# Altium schematic sheet MCU.SchDoc
size 420 x 297 mm; SheetNumber: 7; SheetTotal: 15
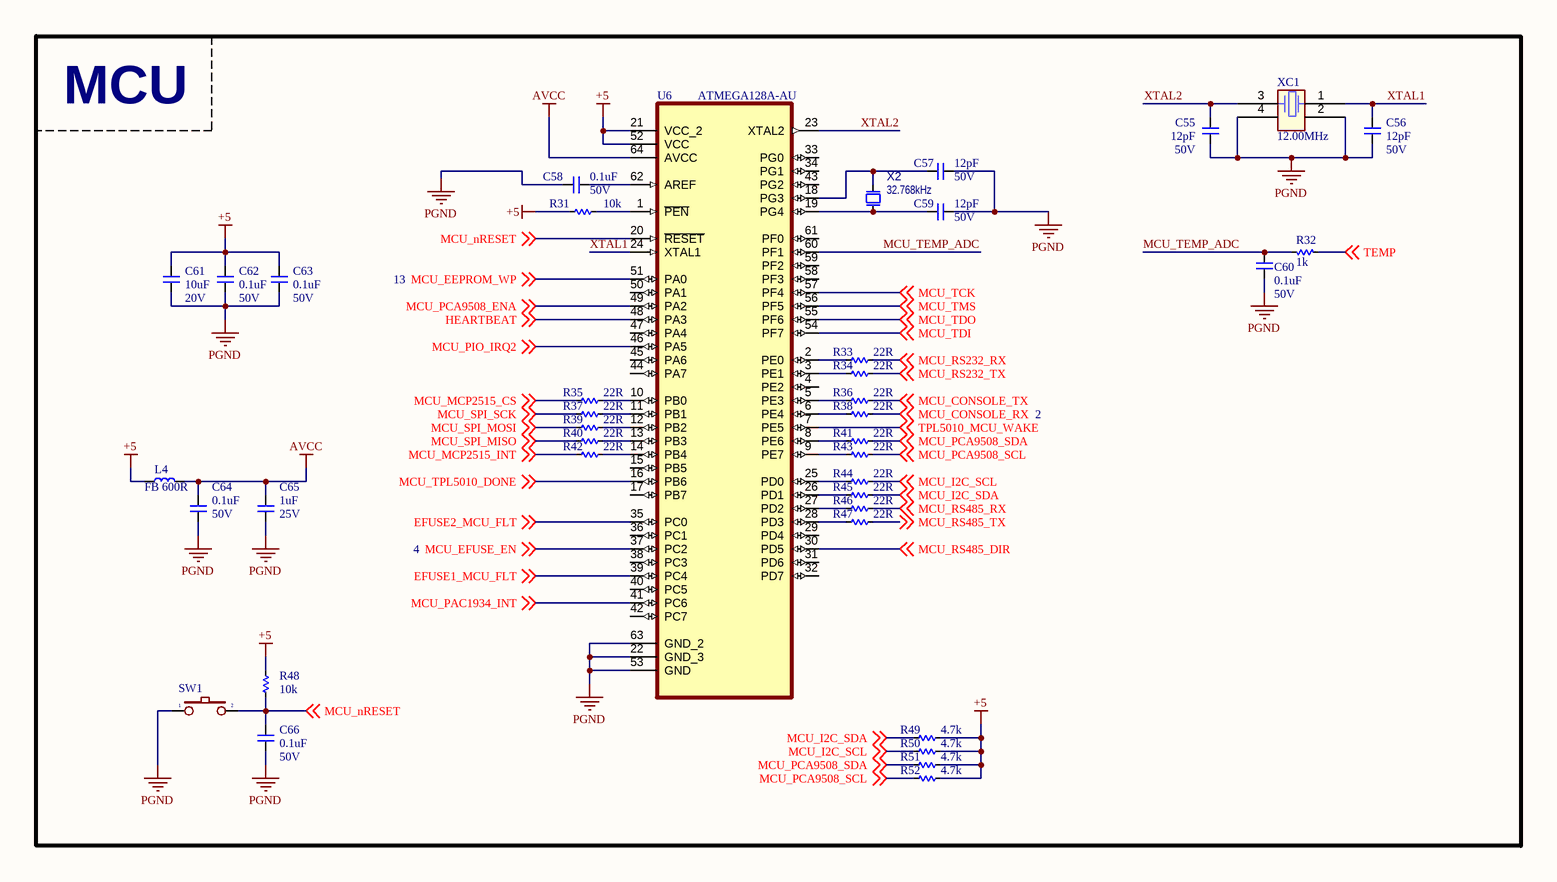
[diagram p0: MCU.SchDoc, left]
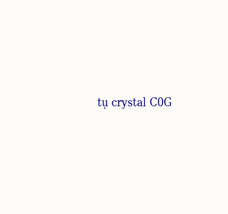
[diagram p1: MCU.SchDoc, right]

## Parts
C55  12pF  Voltage: 50V  [CAP_C_1608X80]
C56  12pF  Voltage: 50V  [CAP_C_1608X80]
C57  12pF  Voltage: 50V  [CAP_C_1608X80]
C58  0.1uF  Voltage: 50V  [CAP_C_1608X80]
C59  12pF  Voltage: 50V  [CAP_C_1608X80]
C60  0.1uF  Voltage: 50V  [CAP_C_1608X80]
C61  10uF  Voltage: 20V  [CAP_C_2012X110]
C62  0.1uF  Voltage: 50V  [CAP_C_1608X80]
C63  0.1uF  Voltage: 50V  [CAP_C_1608X80]
C64  0.1uF  Voltage: 50V  [CAP_C_1608X80]
C65  1uF  Voltage: 25V  [CAP_C_1608X80]
C66  0.1uF  Voltage: 50V  [CAP_C_1608X80]
L4  FB 600R  [L-SMD-0603]
R31  10k  [RES_C_1608X60]
R32  1k  [RES_C_1608X60]
R33  22R  [RES_C_1608X60]
R34  22R  [RES_C_1608X60]
R35  22R  [RES_C_1608X60]
R36  22R  [RES_C_1608X60]
R37  22R  [RES_C_1608X60]
R38  22R  [RES_C_1608X60]
R39  22R  [RES_C_1608X60]
R40  22R  [RES_C_1608X60]
R41  22R  [RES_C_1608X60]
R42  22R  [RES_C_1608X60]
R43  22R  [RES_C_1608X60]
R44  22R  [RES_C_1608X60]
R45  22R  [RES_C_1608X60]
R46  22R  [RES_C_1608X60]
R47  22R  [RES_C_1608X60]
R48  10k  [RES_C_1608X60]
R49  4.7k  [RES_C_1608X60]
R50  4.7k  [RES_C_1608X60]
R51  4.7k  [RES_C_1608X60]
R52  4.7k  [RES_C_1608X60]
SW1  SW2  [SW1-SMD]  (value not drawn)
U6  ATMEGA128A-AU  [TQFP-64]
X2  value 32.768kHz  [CRYSTAL_NX2012SA]  (hidden comment: Crystal 2 Pins)
XC1  value 12.00MHz  [AP7-00039]  (hidden comment: FC5BQCCMC12.0-T1)

## Blocks framed on the sheet
MCU: C55-C66 L4 R31-R52 SW1 U6 X2 XC1

## Nets
+5: C61.2 C62.1 C63.1 L4.1 R31.1 R48.1 R49.1 R50.1 R51.1 R52.1 U6.21(VCC_2) U6.52(VCC)
AVCC: C64.1 C65.1 L4.2 U6.64(AVCC)
PGND: C55.1 C56.1 C57.1 C58.2 C59.1 C60.2 C61.1 C62.2 C63.2 C64.2 C65.2 C66.1 SW1.1 U6.22(GND_3) U6.53(GND) U6.63(GND_2) XC1.2 XC1.4
EFUSE1_MCU_FLT: U6.39(PC4) ; off-sheet EFUSE1_MCU_FLT
EFUSE2_MCU_FLT: U6.35(PC0) ; off-sheet EFUSE2_MCU_FLT
HEARTBEAT: U6.48(PA3) ; off-sheet HEARTBEAT
MCU_CONSOLE_RX: R38.2 ; off-sheet MCU_CONSOLE_RX
MCU_CONSOLE_TX: R36.2 ; off-sheet MCU_CONSOLE_TX
MCU_EEPROM_WP: U6.51(PA0) ; off-sheet MCU_EEPROM_WP
MCU_EFUSE_EN: U6.37(PC2) ; off-sheet MCU_EFUSE_EN
MCU_I2C_SCL: R44.2 R50.2 ; off-sheet MCU_I2C_SCL
MCU_I2C_SDA: R45.2 R49.2 ; off-sheet MCU_I2C_SDA
MCU_MCP2515_CS: R35.1 ; off-sheet MCU_MCP2515_CS
MCU_MCP2515_INT: R42.1 ; off-sheet MCU_MCP2515_INT
MCU_nRESET: C66.2 R48.2 SW1.2 U6.20(~{RESET}) ; off-sheet MCU_nRESET
MCU_PAC1934_INT: U6.41(PC6) ; off-sheet MCU_PAC1934_INT
MCU_PCA9508_ENA: U6.49(PA2) ; off-sheet MCU_PCA9508_ENA
MCU_PCA9508_SCL: R43.2 R52.2 ; off-sheet MCU_PCA9508_SCL
MCU_PCA9508_SDA: R41.2 R51.2 ; off-sheet MCU_PCA9508_SDA
MCU_PIO_IRQ2: U6.46(PA5) ; off-sheet MCU_PIO_IRQ2
MCU_RS232_RX: R33.2 ; off-sheet MCU_RS232_RX
MCU_RS232_TX: R34.2 ; off-sheet MCU_RS232_TX
MCU_RS485_DIR: U6.30(PD5) ; off-sheet MCU_RS485_DIR
MCU_RS485_RX: R46.2 ; off-sheet MCU_RS485_RX
MCU_RS485_TX: R47.2 ; off-sheet MCU_RS485_TX
MCU_SPI_MISO: R40.1 ; off-sheet MCU_SPI_MISO
MCU_SPI_MOSI: R39.1 ; off-sheet MCU_SPI_MOSI
MCU_SPI_SCK: R37.1 ; off-sheet MCU_SPI_SCK
MCU_TCK: U6.57(PF4) ; off-sheet MCU_TCK
MCU_TDI: U6.54(PF7) ; off-sheet MCU_TDI
MCU_TDO: U6.55(PF6) ; off-sheet MCU_TDO
MCU_TEMP_ADC: C60.1 R32.2 U6.60(PF1)
MCU_TMS: U6.56(PF5) ; off-sheet MCU_TMS
MCU_TPL5010_DONE: U6.16(PB6) ; off-sheet MCU_TPL5010_DONE
TEMP: R32.1 ; off-sheet TEMP
TPL5010_MCU_WAKE: U6.7(PE5) ; off-sheet TPL5010_MCU_WAKE
XTAL1: C56.2 U6.24(XTAL1) XC1.1
XTAL2: C55.2 U6.23(XTAL2) XC1.3
NetC57_2: C57.2 U6.18(PG3) X2.2(Osc2)
NetC58_1: C58.1 U6.62(AREF)
NetC59_2: C59.2 U6.19(PG4) X2.1(Osc1)
NetR31_2: R31.2 U6.1(~{PEN})
NetR33_1: R33.1 U6.2(PE0)
NetR34_1: R34.1 U6.3(PE1)
NetR35_2: R35.2 U6.10(PB0)
NetR36_1: R36.1 U6.5(PE3)
NetR37_2: R37.2 U6.11(PB1)
NetR38_1: R38.1 U6.6(PE4)
NetR39_2: R39.2 U6.12(PB2)
NetR40_2: R40.2 U6.13(PB3)
NetR41_1: R41.1 U6.8(PE6)
NetR42_2: R42.2 U6.14(PB4)
NetR43_1: R43.1 U6.9(PE7)
NetR44_1: R44.1 U6.25(PD0)
NetR45_1: R45.1 U6.26(PD1)
NetR46_1: R46.1 U6.27(PD2)
NetR47_1: R47.1 U6.28(PD3)

Not connected (* = marked no-connect by the designer): U6 4(PE2) 15(PB5) 17(PB7) 29(PD4) 31(PD6) 32(PD7) 33(PG0) 34(PG1) 36(PC1) 38(PC3) 40(PC5) 42(PC7) 43(PG2) 44(PA7) 45(PA6) 47(PA4) 50(PA1) 58(PF3) 59(PF2) 61(PF0)

## Notes on the sheet
- tụ crystal C0G
- Project:
- DAL_PDU
- Sub-system:
- IGRVT-50
- Design by:
- KIEN HOANG
- BAO BUI
- Sheet title:
- Sheet
- A3
- of
- Checked by:
- Approved by:
- VU PHAM
- Revision:
- Document No:
- Size:
- Date:

## Library data of the parts
C55-C66 = _CAP_C_2: CAP
L4 = Inductor: Ferrite Bread
R31-R52 = _RES_B_2_2: RES
SW1 = SW2: Switch button 2 pin
X2 = OSC_32.768kHz: Crystal; Manufacturer 1: NDK; Manufacturer Part Number 1: NX2012SA-32.768K-STD-MUB-1; MCHP-ID: OSC1092; Description_: CRYSTAL 32.768kHz 12.5pF SMD NX2012SA; Dev Tools Status: Production; Owner: Jamus Griego; Tolerance: ±20ppm; Load Capacitance: 12.5pF; Populated: YES; Revision: 1; Symbol: Crystal 2 Pins; Status: MCL Design; ComponentLink1URL: https://chn-vm-apps.microchip.com/mchprepo/parts/Datasheets/c_NX2012SA-STD-MUB-1_e.pdf; ComponentLink1Description: SVN Datasheet; ComponentLink2URL: C:\ALTIUM_WORK\00001_MCHP-CDB\Datasheets\c_NX2012SA-STD-MUB-1_e.pdf; ComponentLink2Description: Local Datasheet; ComponentLink3URL: C:\ALTIUM_WORK\00001_MCHP-CDB\Library\LibraryRefs\Crystal 2 Pins.SchLib; ComponentLink3Description: Open Symbol; ComponentLink4URL: C:\ALTIUM_WORK\00001_MCHP-CDB\Library\Footprints\CRYSTAL_NX2012SA.PcbLib; ComponentLink4Description: Open Footprint; ComponentLink5Description: Open Footprint 2; ComponentLink6Description: Open Footprint 3; ComponentLink7Description: Open Footprint 4; Type: Crystal; Category: Crystal/Oscillator; Supplier 1: Digi-Key; Supplier Part Number 1: 644-1219-1-ND; Quantity Override: 1
XC1 = A07-0042: Fox FQ5032B 12.0MHz SMD crystal 738B-12; PartGroup: Frequency devices,Crystals,SMD; Manufacturer: Fox  Electronics; MPN: FQ5032B-12.000; Tolerance: Â±30ppm; TemperatureRange: 0Â°C ~ 70Â°C; AN: A07-0042; Height: 1,20000004768372